# Altium schematic sheet W5100S+POE.SchDoc
size A3; SheetNumber: 2; SheetTotal: 2
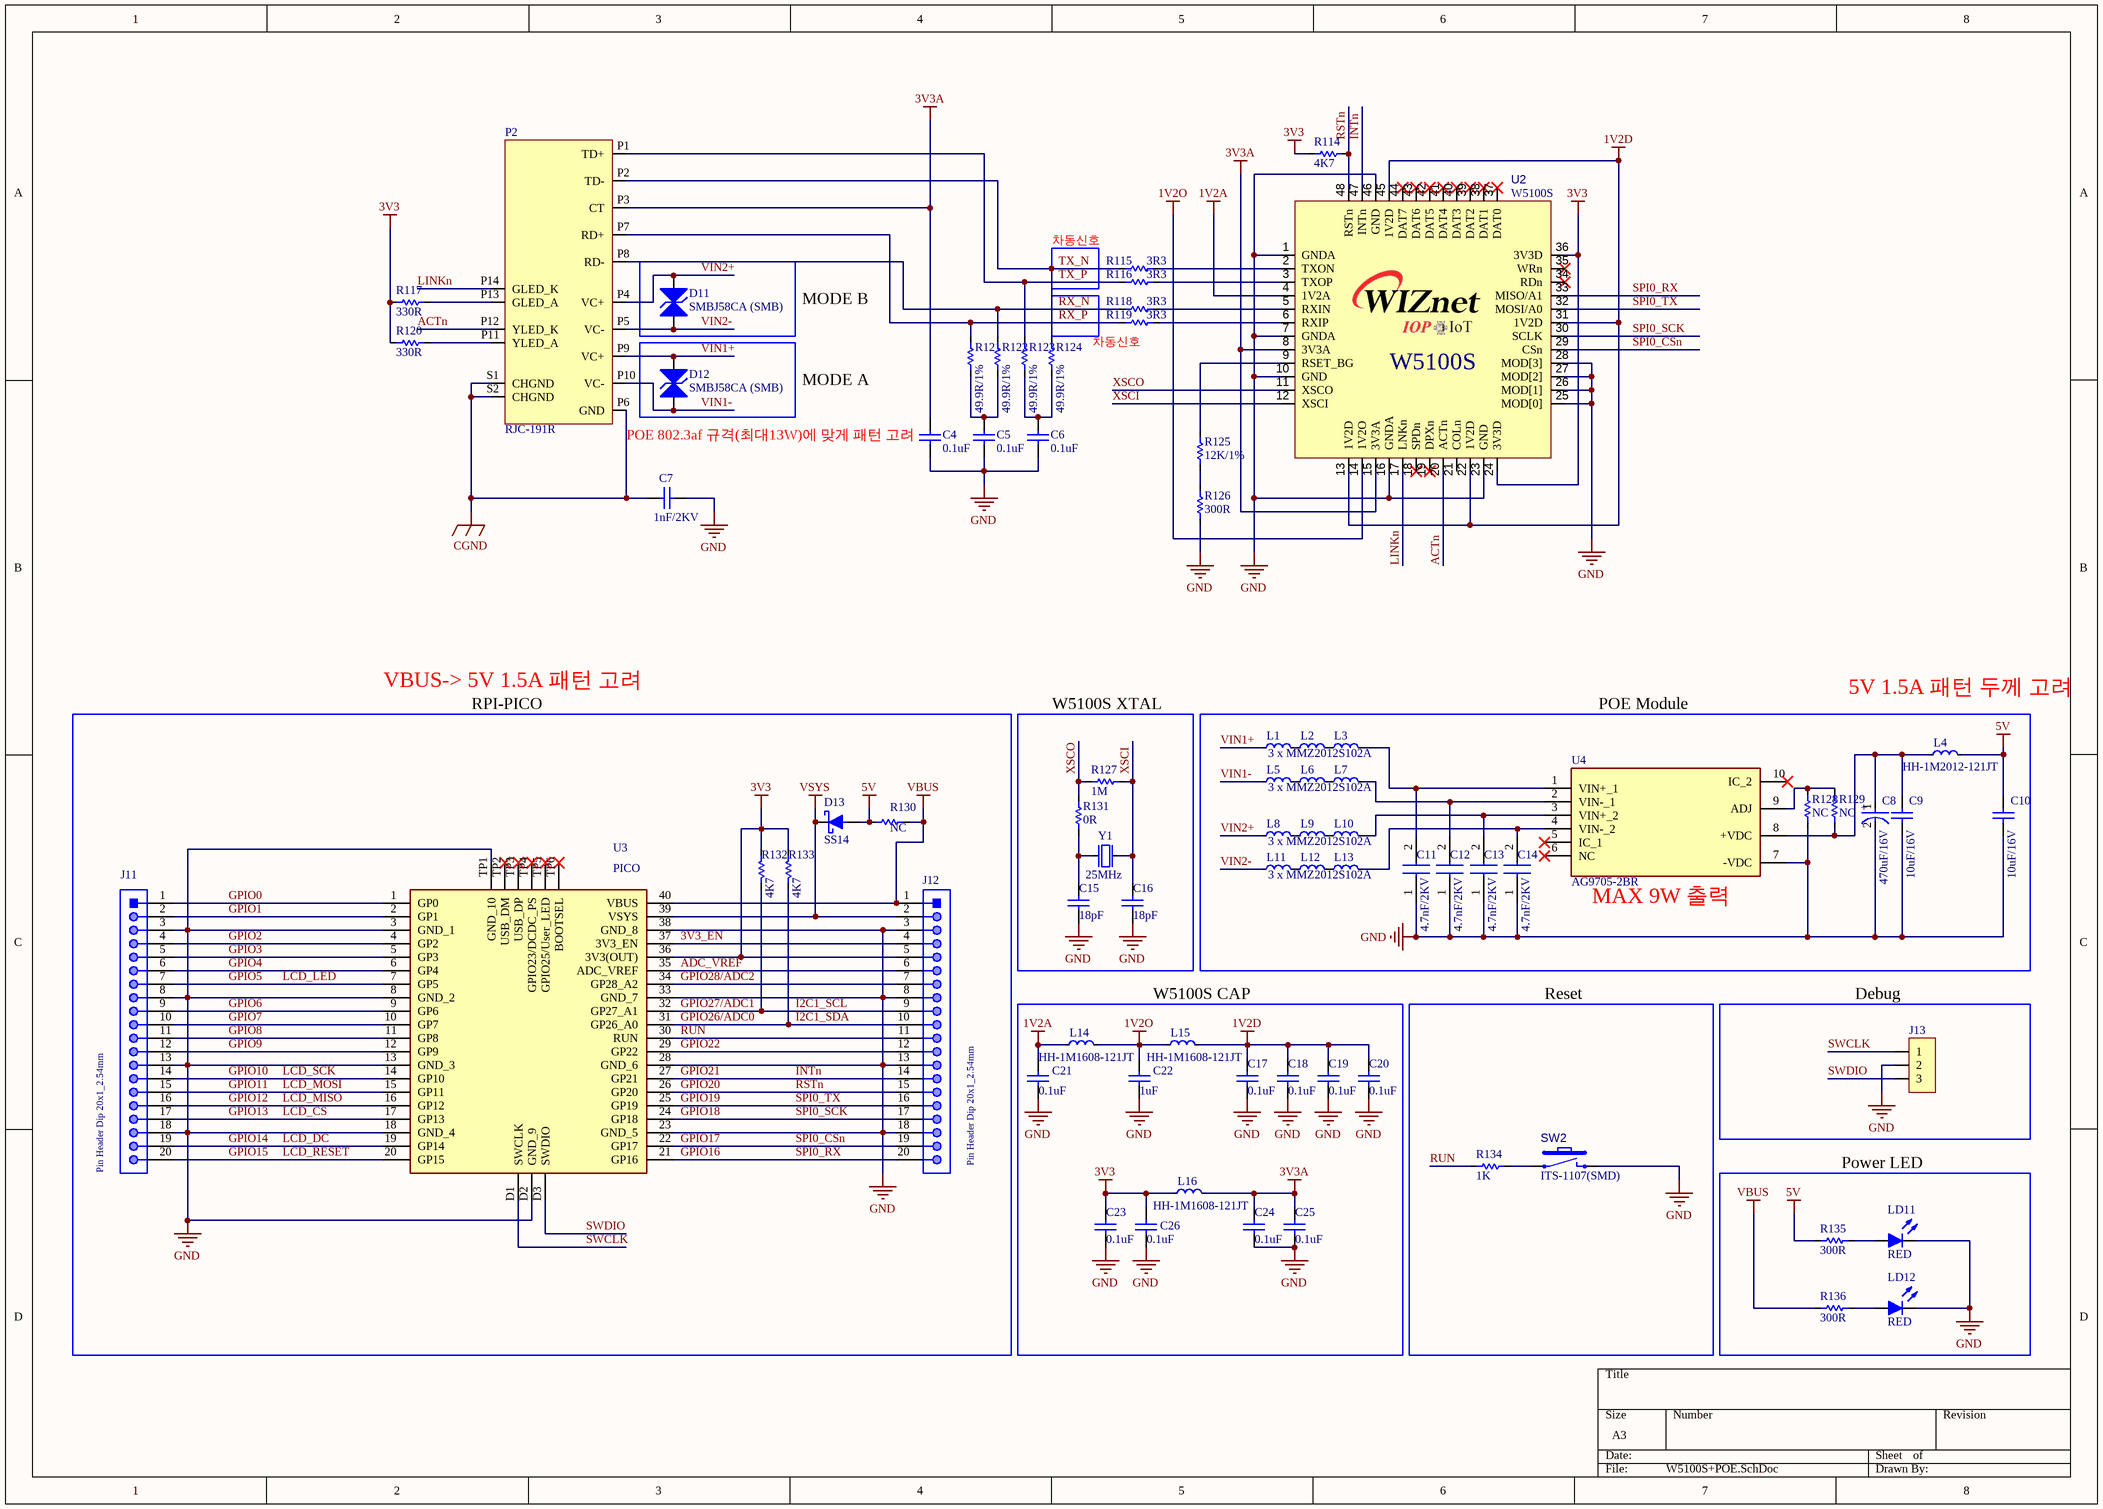
[diagram p0: W5100S+POE.SchDoc]

## Parts
C4  0.1uF  [CAP-0603]
C5  0.1uF  [CAP-0603]
C6  0.1uF  [CAP-0603]
C7  1nF/2KV  [CAP-1808]
C8  470uF/16V  [CAP-8.3EC]
C9  10uF/16V  [CAP-0805]
C10  10uF/16V  [CAP-0805]
C11  4.7nF/2KV  [CK45-E3DD472ZYGNA]
C12  4.7nF/2KV  [CK45-E3DD472ZYGNA]
C13  4.7nF/2KV  [CK45-E3DD472ZYGNA]
C14  4.7nF/2KV  [CK45-E3DD472ZYGNA]
C15  18pF  [CAP-0603]
C16  18pF  [CAP-0603]
C17  0.1uF  [CAP-0603]
C18  0.1uF  [CAP-0603]
C19  0.1uF  [CAP-0603]
C20  0.1uF  [CAP-0603]
C21  0.1uF  [CAP-0603]
C22  1uF  [CAP-0603]
C23  0.1uF  [CAP-0603]
C24  0.1uF  [CAP-0603]
C25  0.1uF  [CAP-0603]
C26  0.1uF  [CAP-0603]
D11  SMBJ58CA (SMB)  [DO-214AA/SMB(TVS)]
D12  SMBJ58CA (SMB)  [DO-214AA/SMB(TVS)]
D13  SS14  [DO-214AC/SMA]
J11  Pin Header Dip 20x1_2.54mm  [IDC-1X20]
J12  Pin Header Dip 20x1_2.54mm  [IDC-1X20]
J13  2.54mm 1x3 Pin Header DIP  [idc-1x3]  (value not drawn)
L1  IND-0805  [IND-0805]  (value not drawn)
L2  IND-0805  [IND-0805]  (value not drawn)
L3  IND-0805  [IND-0805]  (value not drawn)
L4  HH-1M2012-121JT  [IND-0805]
L5  IND-0805  [IND-0805]  (value not drawn)
L6  IND-0805  [IND-0805]  (value not drawn)
L7  IND-0805  [IND-0805]  (value not drawn)
L8  IND-0805  [IND-0805]  (value not drawn)
L9  IND-0805  [IND-0805]  (value not drawn)
L10  IND-0805  [IND-0805]  (value not drawn)
L11  IND-0805  [IND-0805]  (value not drawn)
L12  IND-0805  [IND-0805]  (value not drawn)
L13  IND-0805  [IND-0805]  (value not drawn)
L14  HH-1M1608-121JT  [IND-0603]
L15  HH-1M1608-121JT  [IND-0603]
L16  HH-1M1608-121JT  [IND-0603]
LD11  RED  [LED-0603-RED]
LD12  RED  [LED-0603-RED]
P2  RJC-191R  [RJC-191R]
R114  4K7  [RES-0603]
R115  3R3  [RES-0603]
R116  3R3  [RES-0603]
R117  330R  [RES-0603]
R118  3R3  [RES-0603]
R119  3R3  [RES-0603]
R120  330R  [RES-0603]
R121  49.9R/1%  [RES-0603]
R122  49.9R/1%  [RES-0603]
R123  49.9R/1%  [RES-0603]
R124  49.9R/1%  [RES-0603]
R125  12K/1%  [RES-0603]
R126  300R  [RES-0603]
R127  1M  [RES-0603]
R128  NC  [RES-0603]
R129  NC  [RES-0603]
R130  NC  [RES-0603]
R131  0R  [RES-0603]
R132  4K7  [RES-0603]
R133  4K7  [RES-0603]
R134  1K  [RES-0603]
R135  300R  [RES-0603]
R136  300R  [RES-0603]
SW2  ITS-1107(SMD)  [IT-1107(SMD)]
U2  W5100S  [LQFP48(0.5/9.0)]
U3  PICO  [PICO]
U4  AG9705-2BR  [AG9705-2BR]
Y1  25MHz  [OSC-82J0626]

## Blocks framed on the sheet
RPI-PICO: D13 J11 J12 R130 R132 R133 U3
W5100S XTAL: C15 C16 R127 R131 Y1
W5100S CAP: C17-C26 L14-L16
Reset: R134 SW2
Debug: J13
Power LED: LD11 LD12 R135 R136

## Nets
1V2A: C21.2 L14.1 U2.4(1V2A)
1V2D: C17.2 C18.2 C19.2 C20.2 L15.2 U2.13(1V2D) U2.22(1V2D) U2.31(1V2D) U2.45(1V2D)
1V2O: C22.2 L14.2 L15.1 U2.14(1V2O)
3V3: C23.2 C26.2 J12.5 L16.1 R114.1 R117.1 R120.2 R132.2 R133.2 U2.24(3V3D) U2.36(3V3D) U3.36(3V3(OUT))
3V3A: C4.2 C24.2 C25.2 L16.2 P2.P3(CT) U2.8(3V3A) U2.15(3V3A)
5V: C10.2 D13.1(A) L4.2 R130.1 R135.1
CGND: C7.1 P2.P6(GND) P2.S1(CHGND) P2.S2(CHGND)
GND: C4.1 C5.1 C6.1 C7.2 C8.2(C) C9.1 C10.1 C11.1 C12.1 C13.1 C14.1 C15.1 C16.1 C17.1 C18.1 C19.1 C20.1 C21.1 C22.1 C23.1 C24.1 C25.1 C26.1 J11.3 J11.8 J11.13 J11.18 J12.3 J12.8 J12.13 J12.18 J13.2 LD11.2(K) LD12.2(K) R126.2 R128.2 SW2.2 U2.1(GNDA) U2.7(GNDA) U2.10(GND) U2.16(GNDA) U2.23(GND) U2.25(MOD[0]) U2.26(MOD[1]) U2.27(MOD[2]) U2.28(MOD[3]) U2.46(GND) U3.3(GND_1) U3.8(GND_2) U3.13(GND_3) U3.18(GND_4) U3.23(GND_5) U3.28(GND_6) U3.33(GND_7) U3.38(GND_8) U3.D2(GND_9) U3.TP1(GND_10) U4.7(-VDC) Y1.2(GND) Y1.4(GND)
VBUS: J12.1 R130.2 R136.1 U3.40(VBUS)
VSYS: D13.2(C) J12.2 U3.39(VSYS)
3V3_EN: J12.4 U3.37(3V3_EN)
ACTn: P2.P12(YLED_K) U2.20(ACTn)
ADC_VREF: J12.6 U3.35(ADC_VREF)
GPIO0: J11.1 U3.1(GP0)
GPIO1: J11.2 U3.2(GP1)
GPIO2: J11.4 U3.4(GP2)
GPIO3: J11.5 U3.5(GP3)
GPIO4: J11.6 U3.6(GP4)
GPIO5: J11.7 U3.7(GP5)  [also labelled LCD_LED]
GPIO6: J11.9 U3.9(GP6)
GPIO7: J11.10 U3.10(GP7)
GPIO8: J11.11 U3.11(GP8)
GPIO9: J11.12 U3.12(GP9)
GPIO10: J11.14 U3.14(GP10)  [also labelled LCD_SCK]
GPIO11: J11.15 U3.15(GP11)  [also labelled LCD_MOSI]
GPIO12: J11.16 U3.16(GP12)  [also labelled LCD_MISO]
GPIO13: J11.17 U3.17(GP13)  [also labelled LCD_CS]
GPIO14: J11.19 U3.19(GP14)  [also labelled LCD_DC]
GPIO15: J11.20 U3.20(GP15)  [also labelled LCD_RESET]
GPIO16: J12.20 U2.33(MISO/A1) U3.21(GP16)  [also labelled SPI0_RX]
GPIO17: J12.19 U2.29(CSn) U3.22(GP17)  [also labelled SPI0_CSn]
GPIO18: J12.17 U2.30(SCLK) U3.24(GP18)  [also labelled SPI0_SCK]
GPIO19: J12.16 U2.32(MOSI/A0) U3.25(GP19)  [also labelled SPI0_TX]
GPIO20: J12.15 R114.2 U2.48(RSTn) U3.26(GP20)  [also labelled RSTn]
GPIO21: J12.14 U2.47(INTn) U3.27(GP21)  [also labelled INTn]
GPIO22: J12.12 U3.29(GP22)
GPIO26/ADC0: J12.10 R133.1 U3.31(GP26_A0)  [also labelled I2C1_SDA]
GPIO27/ADC1: J12.9 R132.1 U3.32(GP27_A1)  [also labelled I2C1_SCL]
GPIO28/ADC2: J12.7 U3.34(GP28_A2)
LINKn: P2.P14(GLED_K) U2.17(LNKn)
RUN: J12.11 R134.2 U3.30(RUN)
RX_N: P2.P8(RD-) R118.1 R122.2
RX_P: P2.P7(RD+) R119.1 R121.2
SWCLK: J13.1 U3.D1(SWCLK)
SWDIO: J13.3 U3.D3(SWDIO)
TX_N: P2.P2(TD-) R115.1 R124.2
TX_P: P2.P1(TD+) R116.1 R123.2
VIN1+: D12.2(A2) L1.1 P2.P9(VC+)
VIN1-: D12.1(A1) L5.1 P2.P10(VC-)
VIN2+: D11.2(A2) L8.1 P2.P4(VC+)
VIN2-: D11.1(A1) L11.1 P2.P5(VC-)
XSCI: C16.2 R127.1 U2.12(XSCI) Y1.3(out)
XSCO: R127.2 R131.2 U2.11(XSCO)
NetC5_2: C5.2 R121.1 R122.1
NetC6_2: C6.2 R123.1 R124.1
NetC8_1: C8.1(A) C9.2 L4.1 R129.1 U4.8(+VDC)
NetC11_2: C11.2 L3.2 U4.1(VIN+_1)
NetC12_2: C12.2 L7.2 U4.2(VIN-_1)
NetC13_2: C13.2 L10.2 U4.3(VIN+_2)
NetC14_2: C14.2 L13.2 U4.4(VIN-_2)
NetC15_2: C15.2 R131.1 Y1.1(inp)
NetL1_2: L1.2 L2.1
NetL2_2: L2.2 L3.1
NetL5_2: L5.2 L6.1
NetL6_2: L6.2 L7.1
NetL8_2: L8.2 L9.1
NetL9_2: L9.2 L10.1
NetL11_2: L11.2 L12.1
NetL12_2: L12.2 L13.1
NetLD11_1: LD11.1(A) R135.2
NetLD12_1: LD12.1(A) R136.2
NetP2_P11: P2.P11(YLED_A) R120.1
NetP2_P13: P2.P13(GLED_A) R117.2
NetR115_2: R115.2 U2.2(TXON)
NetR116_2: R116.2 U2.3(TXOP)
NetR118_2: R118.2 U2.5(RXIN)
NetR119_2: R119.2 U2.6(RXIP)
NetR125_1: R125.1 U2.9(RSET_BG)
NetR125_2: R125.2 R126.1
NetR128_1: R128.1 R129.2 U4.9(ADJ)
NetR134_1: R134.1 SW2.1

Not connected (* = marked no-connect by the designer): U2 18(SPDn)* 19(DPXn)* 21(COLn) 34(RDn)* 35(WRn)* 37(DAT0)* 38(DAT1)* 39(DAT2)* 40(DAT3)* 41(DAT4)* 42(DAT5)* 43(DAT6)* 44(DAT7)*; U3 TP2(USB_DM)* TP3(USB_DP)* TP4(GPIO23/DCDC_PS)* TP5(GPIO25/User_LED)* TP6(BOOTSEL)*; U4 5(IC_1)* 6(NC)* 10(IC_2)*

## Notes on the sheet
- 차동신호
- MODE B
- POE 802.3af 규격(최대13W)에 맞게 패턴 고려
- MODE A
- VBUS-> 5V 1.5A 패턴 고려
- POE Module
- 5V 1.5A 패턴 두께 고려
- 3 x MMZ2012S102A
- (near U4) MAX 9W 출력
- (in symbol AL-CAP-D 8.0mm_SMD) +

## Library data of the parts
C4-C6 C15-C26 = CAP-0603: MLCC-0603(1608)
C7 = CAP-1808: MLCC-1808(4520)
C8 = AL-CAP-D 8.0mm_SMD: AL-CAP D: 8.0mm SMD; Leakage Current: 1uA; Dissipation Factor: 6%; Dielectric Material: Tantalum; Voltage Rating: 10V; Polarity: Polar; Capacitance: 10uF; Life (Hours): 2000Hour; Tolerance: 20%; ESR (Equivalent Series Resistance): 4R; Number of Pins: 2; Package Quantity: 2000; Depth: 1.6mm; Radiation Hardening: No; Mount: Surface Mount; Case/Package: 1206; Features: General Purpose; Case Code (Imperial): 1206; Series: T491; Case Code (Metric): 3216; Height: 1.6mm; Voltage Rating (DC): 10V; Width: 0.063inch; Lead Pitch: 1.2mm; Length: 3.2mm; Height - Seated (Max): 0.071inch; Size: 1.6mm; Min Operating Temperature: -55°C; Packaging: Tape and Reel; Weight: 0.000571oz; Construction: Flat; Voltage: 10V; Termination: SMD/SMT; Max Operating Temperature: 125°C; Lead Free: Lead Free; REACH SVHC: No SVHC; RoHS Compliant: Yes
C9 C10 = CAP-0805: MLCC-0805(2012)
C11-C14 = Ceramic Disk Cap: Ceramic Disk Capacitor D: 10.5mm; Manufacturer_Name: TDK; Datasheet Link: https://product.tdk.com/system/files/dam/doc/product/capacitor/ceramic/lead-disc/catalog/leaddisc_commercial_ck45_en.pdf; Height: 14.5mm; Manufacturer_Part_Number: CK45-E3DD472ZYGNA; Mouser Part Number: 810-CK45-E3DD472ZYGN; Mouser Price/Stock: https://www.mouser.co.uk/ProductDetail/TDK/CK45-E3DD472ZYGNA?qs=eSfX1CQlHqqEDnRyEDuzfg%3D%3D
D11 D12 = DIODE-TVS (SMB): PartNumber: SMAJ58CA-E3/61; Manufacturer: Vishay Semiconductor; Manufacturer: Vishay Semiconductors; PPPM (W): 400, 300; ID (uA): 2; IFSM: 40 A; VWM (V): 58; VBR Bi-Directional (V): 6.4 to 231; Packing: Tape and Reel; ComponentLink1Description: Manufacturer URL; PackageDescription: 2-Pin DO-214AC (SMA), Body 4.245 x 2.665 mm; DatasheetVersion: 12/8/2013; ComponentLink2Description: Datasheet; ComponentLink2URL: http://www.vishay.com/docs/88390/smaj50a.pdf; ComponentLink3Description: Package Specification; ComponentLink3URL: http://www.vishay.com/docs/88390/smaj50a.pdf; Operating Junction and Storage Temperature Range: -55 to 150 degC; PackageReference: DO-214AC-2; RoHS: TRUE; ComponentLink1URL: http://www.vishay.com/; Mounting Technology: Surface Mount; Manufacturer Part Number: SMAJ58CA-E3/61
D13 = DIODE-Shottky SMA(DO-214AC): DIODE SCHOTTKY 40V 1A SMA; Manufacturer: ON Semiconductor; Peak Reverse Current: 0.2mA; Max Junction Temp: +125°C; Standoff Height: 0.05mm; Max Surge Forward Current: 40A; Mouser Description: Schottky Diodes & Rectifiers SMA 40V 1.0A; RoHS: TRUE; Lead Free: Yes; Manufacturer Part Number: SS14; Device Class L3: Schottky Diodes; Category: Diode; Automotive: No; Digikey Description: DIODE SCHOTTKY 40V 1A SMA; ComponentLink2Description: Datasheet; Device Class L2: Diodes; Height: 2.5mm; Temperature Range High: +125°C; ComponentLink2URL: https://www.onsemi.com/pub/Collateral/SS19-D.PDF; Device Class L1: Discrete Semiconductors; Package: 403AE; Octopart: https://octopart.com/ss14-on+semiconductor-29205033; Max Repetitive Reverse Voltage: 40V; Temperature Range Low: -65°C; Forward Current: 1A; Temperature: -65°C to +125°C
J11 J12 = Pin Header 20x1_2.54mm: THT Vertical Pin Header WR-PHD, Pitch 2.54 mm, Single Row, 20 pins; Manufacturer: Wurth Elektronik; Part Number: 61302011121; Withstanding Voltage: 500VAC; Gender: Male; Pin Number: 20; Rated Current: 3A; Contact Resistance: 20mOhm; Pitch: 2.54mm; Working Voltage: 250VAC; Publisher: WurthElektronik; Packaging: Bag; Datasheet URL: https://katalog.we-online.de/em/datasheet/6130xx11121.pdf; Row Number: Single; Mounting Technology: THT; Manufacturer URL: http://www.we-online.de; Orientation: Vertical; Package Reference: 61302011121; Operating Temperature: -40to105degC
L1-L13 = IND-0805: Inductor 0805(2012)
L14-L16 = IND-0603: Inductor 0603(1608)
LD11 LD12 = RED LED-0603: LED-0603
P2 = RJC-191R: PoE RJ45
R114-R136 = RES-0603: Chip Resistor 0603(1608); Manufacturer: Yageo; Power Rating: 100mW; Voltage Rating: 50V; Tolerance: 1%; Temperature Coefficient: 100ppm/degreesC; Resistance: 1.5KOhm; Military Standard: Not; Datasheet URL: http://www.yageo.com/NewPortal/yageodocoutput?fileName=/pdf/R-Chip/PYu-RC_Group_51_RoHS_L_5.pdf; Package Description: 2-Pin Surface Mount Device, Body 1.6 x 0.8 mm; Composition: ThickFilm; Case Code (Metric): 1608; Case/Package: 0603; Number of Terminations: 2; Depth: 0.8mm; Height: 0.022inch; Manufacturer URL: http://www.yageo.com/; Lead Free: LeadFree; Min Operating Temperature: -55degC; Max Operating Temperature: 155degC; Datasheet Version: Rev. 5, 10/2016; RoHSCompliant: true; Max Power Dissipation: 100mW; Packaging: TapeandReel; Voltage Rating (DC): 50V; Length: 0.063inch; Width: 0.031inch; Number of Pins: 2; Termination: SMD/SMT; Package Reference: 0603; Package Quantity: 1; Case Code (Imperial): 0603; REACH SVHC: NoSVHC
SW2 = ITS-1107(SMD): TACT Switch (SMD)
U2 = W5100S: WIZnet Hardwired TCP/IP Chip
U3 = PICO: Module; Manufacturer_Name: RASPBERRY-PI; Datasheet Link: https://datasheets.raspberrypi.org/pico/pico_datasheet.pdf; Height: 1mm; Manufacturer_Part_Number: PICO
U4 = AG9700: Integrated Circuit; Manufacturer_Name: Silvertel; Datasheet Link: http://silvertel.com/images/datasheets/Ag9700-Datasheet-low-cost-isolated-Power-over-Ethernet-PoE-module-solution.pdf; Height: 14mm; Manufacturer_Part_Number: AG9700
Y1 = OSC-82J0626-25MHz: X-tal 25MHz,3.2x2.5 SMD, CL=18pF